# EAGLE schematic TLog_HighSpeedADC (EAGLE 8.3.0)

## Sheet 1 of 7: Main
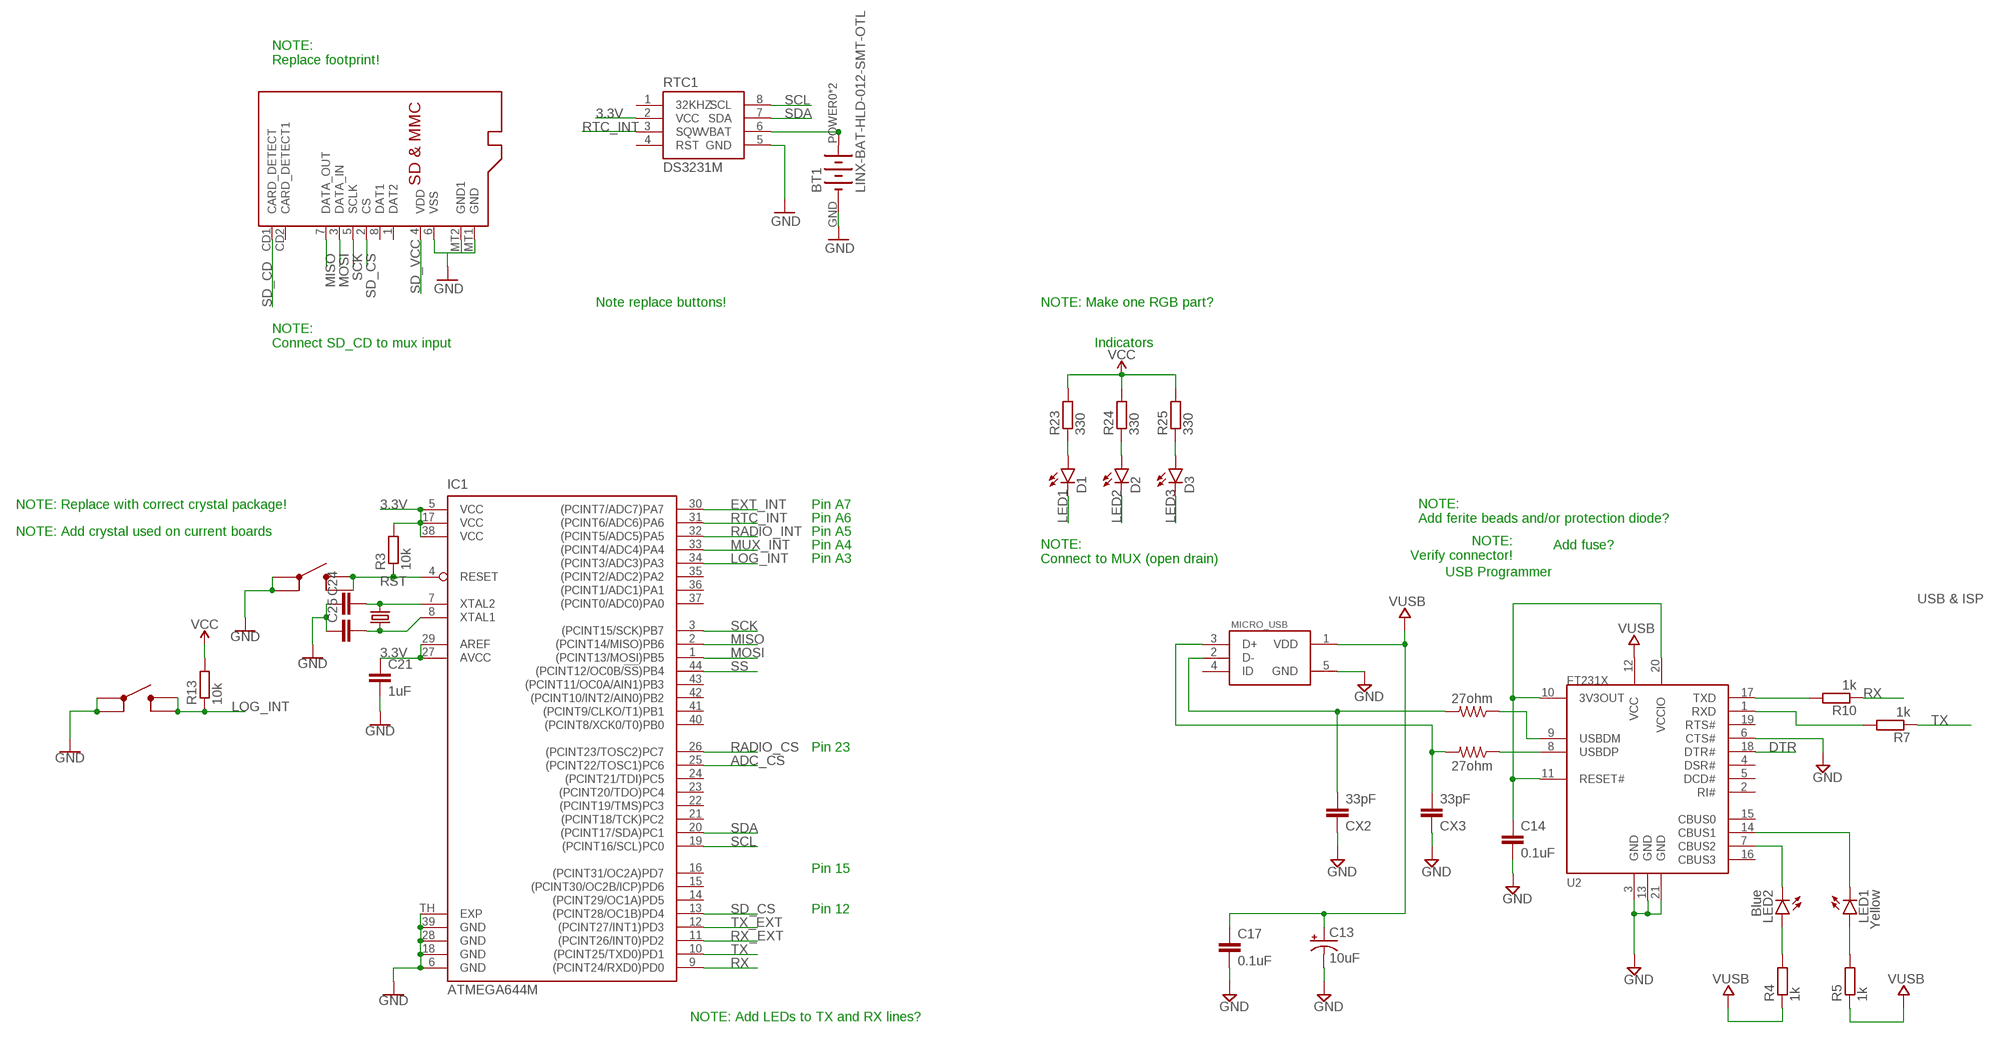
[diagram p0: schematic, sheet 1]

### Parts
BT1  LINX-BAT-HLD-012-SMT-OTL  [LINX_BAT-HLD-012-SMT]
C13  10uF  CAP_POL1206  [EIA3216]
C14  0.1uF  C-EUC0603  [C0603]
C17  0.1uF  C-EUC0603  [C0603]
C21  1uF  C-EUC0603  [C0603]
C24  C-EUC0603  [C0603]
C25  C-EUC0603  [C0603]
CX2  33pF  C-EUC0603  [C0603]
CX3  33pF  C-EUC0603  [C0603]
D1  LED0603  [LED-0603]
D2  LED0603  [LED-0603]
D3  LED0603  [LED-0603]
D+  27ohm  R-US_R0603  [R0603]
D-  27ohm  R-US_R0603  [R0603]
IC1  ATMEGA644M  [MLF44-TH]
LED1  Yellow  LED0603  [LED-0603]
LED2  Blue  LED0603  [LED-0603]
MICRO_USB  10118194-0001LF_LONGER_PADS  [10118194-0001LF_LONGER_PADS]
R3  10k  R-EU_R0603  [R0603]
R4  1k  R-EU_R0603  [R0603]
R5  1k  R-EU_R0603  [R0603]
R7  1k  R-EU_R0603  [R0603]
R10  1k  R-EU_R0603  [R0603]
R13  10k  R-EU_R0603  [R0603]
R23  330  R-EU_R0603  [R0603]
R24  330  R-EU_R0603  [R0603]
R25  330  R-EU_R0603  [R0603]
RTC1  DS3231M  [SO08]
U2  FT231X-Q  [QFN20]
U$1  CRYSTAL_5X3.2_2LEAD  [CRYSTAL_5X3.2_2-SMD]
U$2  MICROSD  [MICROSD]
U$5  SKRPABE010  [SKRPABE010_(SWITCH)]
U$9  SKRPABE010  [SKRPABE010_(SWITCH)]

### Nets
3.3V: C21.1 IC1.5(VCC) IC1.17(VCC) IC1.27(AVCC) IC1.29(AREF) IC1.38(VCC) R3.2 R13.2 R23.2 R24.2 R25.2 RTC1.2(VCC) ; supply symbol labelled VCC ; also sheet 3,4,5,6,7
ADC_CS: IC1.25((PCINT22/TOSC1)PC6)
DTR: U2.18(DTR#)
EXT_INT: IC1.30((PCINT7/ADC7)PA7) ; also sheet 6
GND: BT1.GND(-) C13.C(-) C14.2 C17.2 C21.2 C24.1 C25.1 CX2.1 CX3.1 IC1.6(GND) IC1.18(GND) IC1.28(GND) IC1.39(GND) IC1.TH(EXP) MICRO_USB.5(GND) RTC1.5(GND) U2.3(GND) U2.6(CTS#) U2.13(GND) U2.21(GND) U$2.6(VSS) U$2.MT1(GND) U$2.MT2(GND1) U$5.P$1 U$5.P$2 U$9.P$1 U$9.P$2 ; also sheet 2,3,4,5,6,7
LED1: D1.C ; also sheet 7
LED2: D2.C ; also sheet 7
LED3: D3.C ; also sheet 7
LOG_INT: IC1.34((PCINT3/ADC3)PA3) R13.1 U$5.P$3 U$5.P$4
MISO: IC1.2((PCINT14/MISO)PB6) U$2.7(DATA_OUT) ; also sheet 4,6
MOSI: IC1.1((PCINT13/MOSI)PB5) U$2.3(DATA_IN) ; also sheet 4,6
MUX_INT: IC1.33((PCINT4/ADC4)PA4) ; also sheet 7
N$5: C24.2 IC1.7(XTAL2) U$1.P$2
N$8: C25.2 IC1.8(XTAL1) U$1.P$1
N$25: R10.2 U2.17(TXD)
N$31: BT1.POWER0(+) BT1.POWER1(+) RTC1.6(VBAT)
N$32: D1.A R23.1
N$33: D2.A R24.1
N$34: D3.A R25.1
N$35: R7.2 U2.1(RXD)
N$36: CX3.2 D+.2 MICRO_USB.3(D+)
N$37: CX2.2 D-.2 MICRO_USB.2(D-)
N$38: D+.1 U2.8(USBDP)
N$39: C14.1 U2.10(3V3OUT) U2.11(RESET#) U2.20(VCCIO)
N$40: LED2.A R4.2
N$41: LED2.C U2.7(CBUS2)
N$42: LED1.A R5.2
N$43: LED1.C U2.14(CBUS1)
N$46: D-.1 U2.9(USBDM)
RADIO_CS: IC1.26((PCINT23/TOSC2)PC7) ; also sheet 4
RADIO_INT: IC1.32((PCINT5/ADC5)PA5) ; also sheet 4
RST: IC1.4(RESET) R3.1 U$9.P$3 U$9.P$4 ; also sheet 6
RTC_INT: IC1.31((PCINT6/ADC6)PA6) RTC1.3(SQW)
RX: IC1.9((PCINT24/RXD0)PD0) R10.1
RX_EXT: IC1.11((PCINT26/INT0)PD2) ; also sheet 6
SCK: IC1.3((PCINT15/SCK)PB7) U$2.5(SCLK) ; also sheet 4,6
SCL: IC1.19((PCINT16/SCL)PC0) RTC1.8(SCL) ; also sheet 4,6,7
SD_CD: U$2.CD1(CARD_DETECT)
SD_CS: IC1.13((PCINT28/OC1B)PD4) U$2.2(CS)
SD_VCC: U$2.4(VDD) ; also sheet 5
SDA: IC1.20((PCINT17/SDA)PC1) RTC1.7(SDA) ; also sheet 4,6,7
SS: IC1.44((PCINT12/OC0B/!SS!)PB4)
TX: IC1.10((PCINT25/TXD0)PD1) R7.1
TX_EXT: IC1.12((PCINT27/INT1)PD3) ; also sheet 6
VUSB: C13.A(+) C17.1 MICRO_USB.1(VDD) R4.1 R5.1 U2.12(VCC)
Unconnected: IC1.14((PCINT29/OC1A)PD5) IC1.15((PCINT30/OC2B/ICP)PD6) IC1.16((PCINT31/OC2A)PD7) IC1.21((PCINT18/TCK)PC2) IC1.22((PCINT19/TMS)PC3) IC1.23((PCINT20/TDO)PC4) IC1.24((PCINT21/TDI)PC5) IC1.35((PCINT2/ADC2)PA2) IC1.36((PCINT1/ADC1)PA1) IC1.37((PCINT0/ADC0)PA0) IC1.40((PCINT8/XCK0/T0)PB0) IC1.41((PCINT9/CLKO/T1)PB1) IC1.42((PCINT10/INT2/AIN0)PB2) IC1.43((PCINT11/OC0A/AIN1)PB3) MICRO_USB.4(ID) RTC1.1(32KHZ) RTC1.4(RST) U2.2(RI#) U2.4(DSR#) U2.5(DCD#) U2.15(CBUS0) U2.16(CBUS3) U2.19(RTS#) U$2.1(DAT2) U$2.8(DAT1) U$2.CD2(CARD_DETECT1)

### Notes on the sheet
- NOTE:
  Replace footprint!
- Note replace buttons! | NOTE: Make one RGB part?
- NOTE:
  Connect SD_CD to mux input
- Indicators
- NOTE: Replace with correct crystal package! | Pin A7
- Pin A6
- NOTE:
  Add ferite beads and/or protection diode?
- NOTE: Add crystal used on current boards | Pin A5
- NOTE:
  Verify connector!
- Pin A4 | Add fuse?
- Pin A3
- NOTE:
  Connect to MUX (open drain)
- USB Programmer
- USB & ISP
- Pin 23
- Pin 15
- Pin 12
- NOTE: Add LEDs to TX and RX lines?

## Sheet 2 of 7: User Custom
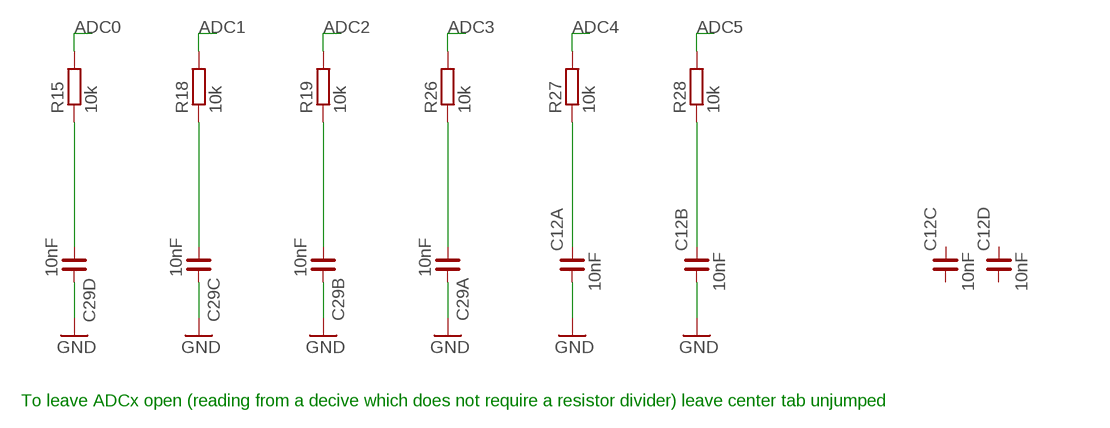
[diagram p1: schematic, sheet 2]

### Parts
C12  10nF  CCA_ECJ-1206  [CECJ-1206]
C29  10nF  CCA_ECJ-1206  [CECJ-1206]
R15  10k  R-EU_R0603  [R0603]
R18  10k  R-EU_R0603  [R0603]
R19  10k  R-EU_R0603  [R0603]
R26  10k  R-EU_R0603  [R0603]
R27  10k  R-EU_R0603  [R0603]
R28  10k  R-EU_R0603  [R0603]

### Nets
ADC0: R15.2 ; also sheet 6,7
ADC1: R18.2 ; also sheet 6,7
ADC2: R19.2 ; also sheet 6,7
ADC3: R26.2 ; also sheet 6,7
ADC4: R27.2 ; also sheet 6,7
ADC5: R28.2 ; also sheet 6,7
GND: C12.A1 C12.B1 C29.A2 C29.B2 C29.C2 C29.D2 ; also sheet 1,3,4,5,6,7
N$17: C12.B2 R28.1
N$19: C29.B1 R19.1
N$24: C29.A1 R26.1
N$44: C29.D1 R15.1
N$45: C29.C1 R18.1
N$48: C12.A2 R27.1
Unconnected: C12.C1 C12.C2 C12.D1 C12.D2

### Notes on the sheet
- To leave ADCx open (reading from a decive which does not require a resistor divider) leave center tab unjumped

## Sheet 3 of 7: Power
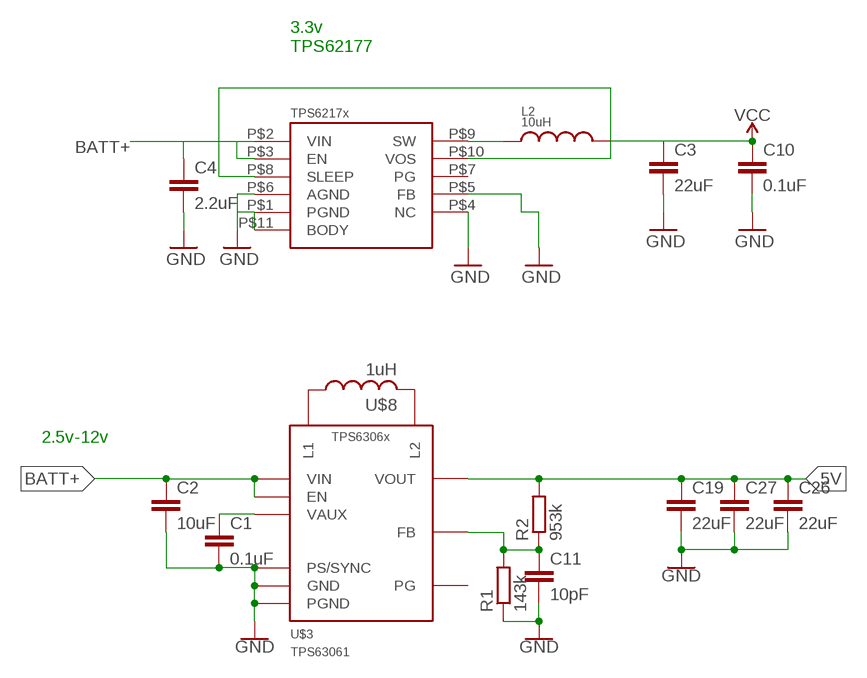
[diagram p2: schematic, sheet 3]

### Parts
C1  0.1uF  C-EUC0603  [C0603]
C2  10uF  C-EUC0603  [C0603]
C3  22uF  C-EUC1210  [C1210]
C4  2.2uF  C-EUC0603  [C0603]
C10  0.1uF  C-EUC0603  [C0603]
C11  10pF  C-EUC0603  [C0603]
C19  22uF  C-EUC0603  [C0603]
C26  22uF  C-EUC0603  [C0603]
C27  22uF  C-EUC0603  [C0603]
L2  10uH  WE-LSQ(INDUCTOR)  [WE-LQS(INDUCTOR)]
R1  143k  R-EU_R0603  [R0603]
R2  953k  R-EU_R0603  [R0603]
U$3  TPS63061  TPS306X  [WSON-10]
U$4  TPS6217X  [WSON-10]
U$8  1uH  WE-MAIA(INDUCTOR)  [WE-MAIA(4.1X4.1)]

### Nets
3.3V: C3.1 C10.1 L2.P$2 U$4.P$8(SLEEP) U$4.P$10(VOS) ; supply symbol labelled VCC ; also sheet 1,4,5,6,7
5V: C19.1 C26.1 C27.1 R2.2 U$3.P$9(VOUT) ; also sheet 5,6,7
BATT+: C2.1 C4.1 U$3.P$2(VIN) U$3.P$3(EN) U$4.P$2(VIN) U$4.P$3(EN) ; also sheet 6,7
GND: C1.2 C2.2 C3.2 C4.2 C10.2 C11.2 C19.2 C26.2 C27.2 R1.1 U$3.P$4(PS/SYNC) U$3.P$7(GND) U$3.P$11(PGND) U$4.P$1(PGND) U$4.P$4(NC) U$4.P$5(FB) U$4.P$6(AGND) U$4.P$11(BODY) ; also sheet 1,2,4,5,6,7
N$1: U$3.P$10(L2) U$8.P$2
N$2: L2.P$1 U$4.P$9(SW)
N$3: U$3.P$1(L1) U$8.P$1
N$4: C1.1 U$3.P$6(VAUX)
N$6: C11.1 R1.2 R2.1 U$3.P$8(FB)
Unconnected: U$3.P$5(PG) U$4.P$7(PG)

### Notes on the sheet
- 3.3v
  TPS62177
- 2.5v-12v

## Sheet 4 of 7: RF
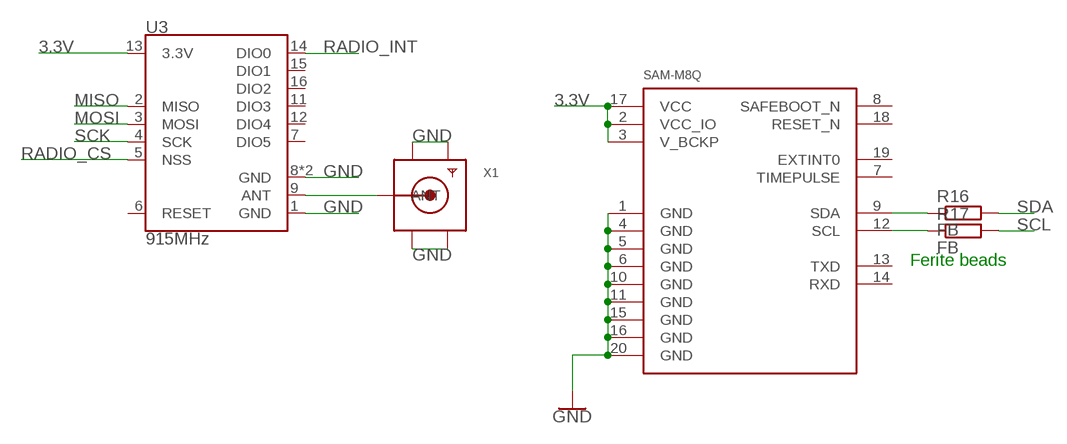
[diagram p3: schematic, sheet 4]

### Parts
R16  FB  R-EU_R0603  [R0603]
R17  FB  R-EU_R0603  [R0603]
U3  915MHz  RFM69HCW-915  [RFM69HCW-XXXS2]
U$6  SAM-M8Q  [SAM-M8Q]
X1  SMACONNECTOR_EDGE  [SMA_EDGELAUNCH]

### Nets
3.3V: U3.13(3.3V) U$6.2(VCC_IO) U$6.3(V_BCKP) U$6.17(VCC) ; also sheet 1,3,5,6,7
GND: U3.1(GND) U3.8(GND) U3.10(GND) U$6.1(GND) U$6.4(GND) U$6.5(GND) U$6.6(GND) U$6.10(GND) U$6.11(GND) U$6.15(GND) U$6.16(GND) U$6.20(GND) X1.GND@1(GND4) X1.GND@2(GND3) X1.GND@3(GND2) X1.GND@4(GND1) ; also sheet 1,2,3,5,6,7
MISO: U3.2(MISO) ; also sheet 1,6
MOSI: U3.3(MOSI) ; also sheet 1,6
N$20: R16.1 U$6.9(SDA)
N$21: R17.1 U$6.12(SCL)
N$28: U3.9(ANT) X1.P(ANT)
RADIO_CS: U3.5(NSS) ; also sheet 1
RADIO_INT: U3.14(DIO0) ; also sheet 1
SCK: U3.4(SCK) ; also sheet 1,6
SCL: R17.2 ; also sheet 1,6,7
SDA: R16.2 ; also sheet 1,6,7
Unconnected: U3.6(RESET) U3.7(DIO5) U3.11(DIO3) U3.12(DIO4) U3.15(DIO1) U3.16(DIO2) U$6.7(TIMEPULSE) U$6.8(SAFEBOOT_N) U$6.13(TXD) U$6.14(RXD) U$6.18(RESET_N) U$6.19(EXTINT0)

### Notes on the sheet
- Ferite beads

## Sheet 5 of 7: Power Control
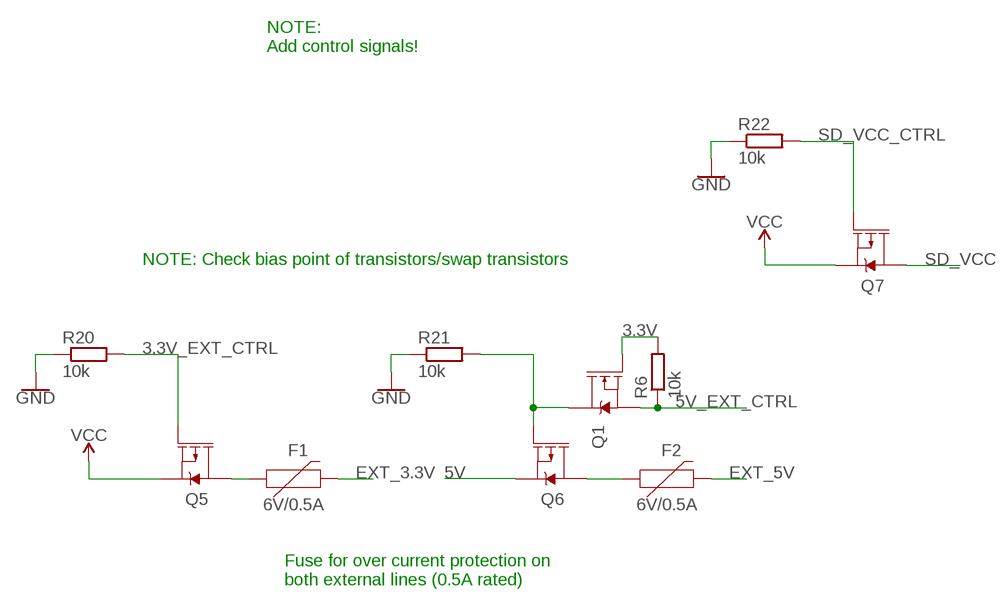
[diagram p4: schematic, sheet 5]

### Parts
F1  6V/0.5A  PPTC_HALF-AMP  [1206]
F2  6V/0.5A  PPTC_HALF-AMP  [1206]
Q1  220mA/50V/3.5Ω  MOSFET-NCH-BSS138  [SOT23-3]
Q5  4.3A/20V/54mΩ  MOSFET_PCH-IRLML2244  [SOT23-3]
Q6  4.3A/20V/54mΩ  MOSFET_PCH-IRLML2244  [SOT23-3]
Q7  4.3A/20V/54mΩ  MOSFET_PCH-IRLML2244  [SOT23-3]
R6  10k  R-EU_R0603  [R0603]
R20  10k  R-EU_R0603  [R0603]
R21  10k  R-EU_R0603  [R0603]
R22  10k  R-EU_R0603  [R0603]

### Nets
3.3V: Q1.1(G) Q5.2(S) Q7.2(S) R6.2 ; supply symbol labelled VCC ; also sheet 1,3,4,6,7
3.3V_EXT_CTRL: Q5.1(G) R20.2 ; also sheet 7
5V: Q6.2(S) ; also sheet 3,6,7
5V_EXT_CTRL: Q1.2(S) R6.1 ; also sheet 7
EXT_3.3V: F1.2 ; also sheet 6
EXT_5V: F2.2 ; also sheet 6
GND: R20.1 R21.1 R22.1 ; also sheet 1,2,3,4,6,7
N$14: F1.1 Q5.3(D)
N$18: F2.1 Q6.3(D)
N$30: Q1.3(D) Q6.1(G) R21.2
SD_VCC: Q7.3(D) ; also sheet 1
SD_VCC_CTRL: Q7.1(G) R22.2 ; also sheet 7

### Notes on the sheet
- NOTE:
  Add control signals!
- NOTE: Check bias point of transistors/swap transistors
- Fuse for over current protection on
  both external lines (0.5A rated)

## Sheet 6 of 7: Ports
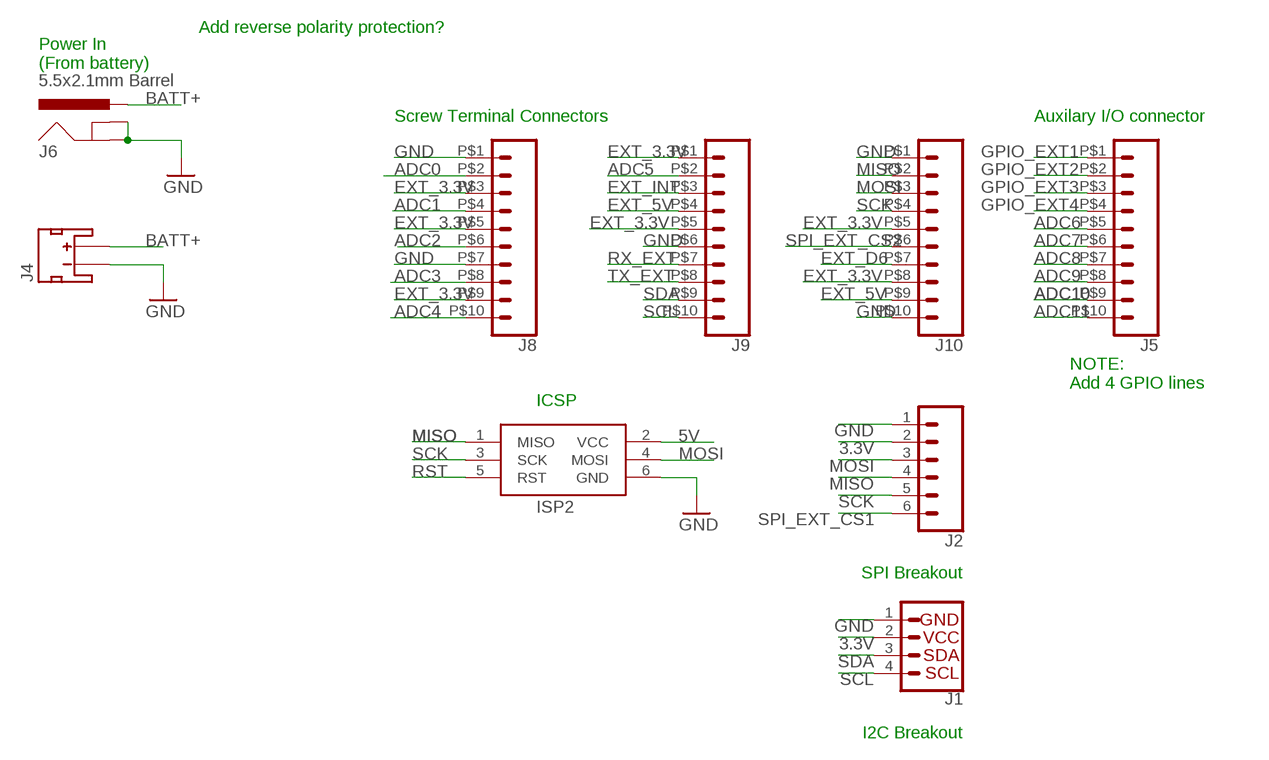
[diagram p5: schematic, sheet 6]

### Parts
ISP2  AVRISP-6  [AVRISP]
J1  I2C_STANDARD  [1X04]
J2  CONN_06SILK_FEMALE_PTH  [1X06]
J4  JST_2MM_MALE  [JST-2-SMD]
J5  CONN_10  [SCREWTERMINAL-3.5MM-10]
J6  5.5x2.1mm Barrel  POWER_JACKSMD  [POWER_JACK_SMD]
J8  CONN_10  [SCREWTERMINAL-3.5MM-10]
J9  CONN_10  [SCREWTERMINAL-3.5MM-10]
J10  CONN_10  [SCREWTERMINAL-3.5MM-10]

### Nets
3.3V: J1.2 J2.2 ; also sheet 1,3,4,5,7
5V: ISP2.2(VCC) ; also sheet 3,5,7
ADC0: J8.P$2 ; also sheet 2,7
ADC1: J8.P$4 ; also sheet 2,7
ADC2: J8.P$6 ; also sheet 2,7
ADC3: J8.P$8 ; also sheet 2,7
ADC4: J8.P$10 ; also sheet 2,7
ADC5: J9.P$2 ; also sheet 2,7
ADC6: J5.P$5 ; also sheet 7
ADC7: J5.P$6 ; also sheet 7
ADC8: J5.P$7 ; also sheet 7
ADC9: J5.P$8 ; also sheet 7
ADC10: J5.P$9 ; also sheet 7
ADC11: J5.P$10 ; also sheet 7
BATT+: J4.2(+) J6.VIN0(PWR) ; also sheet 3,7
EXT_3.3V: J8.P$3 J8.P$5 J8.P$9 J9.P$1 J9.P$5 J10.P$5 J10.P$8 ; also sheet 5
EXT_5V: J9.P$4 J10.P$9 ; also sheet 5
EXT_D6: J10.P$7 ; also sheet 7
EXT_INT: J9.P$3 ; also sheet 1
GND: ISP2.6(GND) J1.1 J2.1 J4.1(-) J6.GND(GNDBREAK) J6.P$4(GND) J8.P$1 J8.P$7 J9.P$6 J10.P$1 J10.P$10 ; also sheet 1,2,3,4,5,7
GPIO_EXT1: J5.P$1 ; also sheet 7
GPIO_EXT2: J5.P$2 ; also sheet 7
GPIO_EXT3: J5.P$3 ; also sheet 7
GPIO_EXT4: J5.P$4 ; also sheet 7
MISO: ISP2.1(MISO) J2.4 J10.P$2 ; also sheet 1,4
MOSI: ISP2.4(MOSI) J2.3 J10.P$3 ; also sheet 1,4
RST: ISP2.5(RST) ; also sheet 1
RX_EXT: J9.P$7 ; also sheet 1
SCK: ISP2.3(SCK) J2.5 J10.P$4 ; also sheet 1,4
SCL: J1.4 J9.P$10 ; also sheet 1,4,7
SDA: J1.3 J9.P$9 ; also sheet 1,4,7
SPI_EXT_CS1: J2.6 ; also sheet 7
SPI_EXT_CS2: J10.P$6 ; also sheet 7
TX_EXT: J9.P$8 ; also sheet 1
Unconnected: J4.NC1(PAD1) J4.NC2(PAD2)

### Notes on the sheet
- Add reverse polarity protection?
- Power In
  (From battery)
- Screw Terminal Connectors | Auxilary I/O connector
- NOTE:
  Add 4 GPIO lines
- ICSP
- SPI Breakout
- I2C Breakout

## Sheet 7 of 7: IO
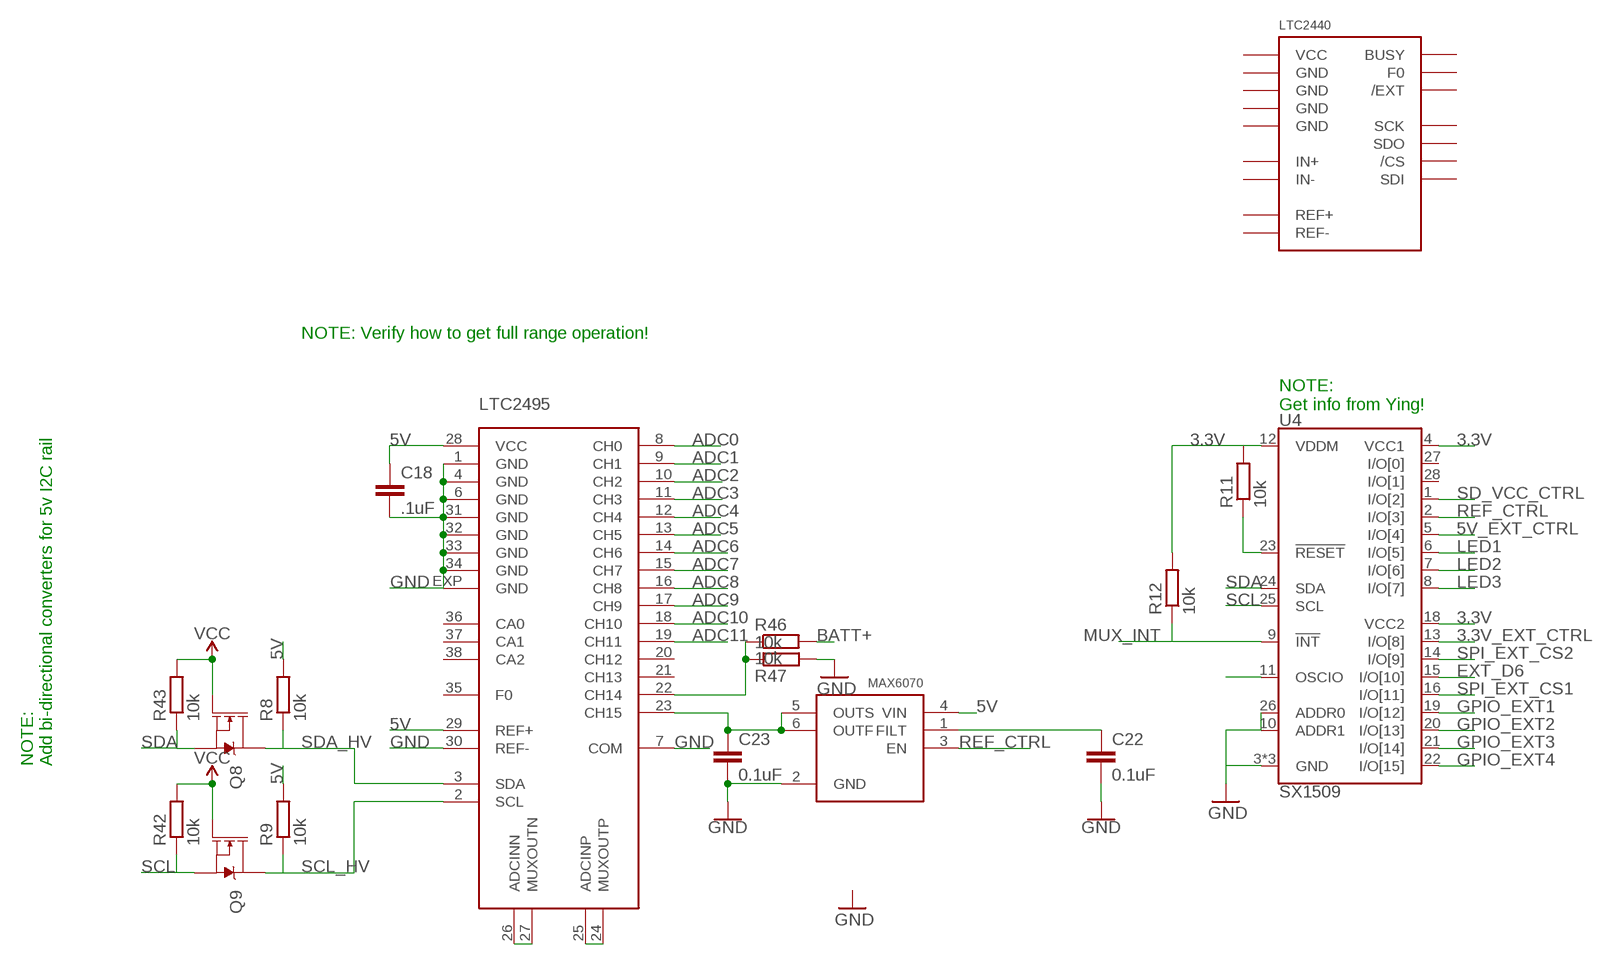
[diagram p6: schematic, sheet 7]

### Parts
C18  .1uF  C-EUC0603  [C0603]
C22  0.1uF  C-EUC0603  [C0603]
C23  0.1uF  C-EUC0603  [C0603]
Q8  220mA/50V/3.5Ω  MOSFET-NCH-BSS138  [SOT23-3]
Q9  220mA/50V/3.5Ω  MOSFET-NCH-BSS138  [SOT23-3]
R8  10k  R-EU_R0603  [R0603]
R9  10k  R-EU_R0603  [R0603]
R11  10k  R-EU_R0603  [R0603]
R12  10k  R-EU_R0603  [R0603]
R42  10k  R-EU_R0603  [R0603]
R43  10k  R-EU_R0603  [R0603]
R46  10k  R-EU_R0603  [R0603]
R47  10k  R-EU_R0603  [R0603]
U4  SX1509  [QFN-28]
U$7  LTC2495  [QFN38-5X7]
U$10  MAX6070  [SOT23-6L]
U$15  LTC2440  [SSOP16]

### Nets
3.3V: Q8.1(G) Q9.1(G) R11.2 R12.2 R42.2 R43.2 U4.4(VCC1) U4.12(VDDM) U4.18(VCC2) ; supply symbol labelled VCC ; also sheet 1,3,4,5,6
3.3V_EXT_CTRL: U4.13(I/O[8]) ; also sheet 5
5V: C18.1 R8.2 R9.2 U$7.28(VCC) U$7.29(REF+) U$10.4(VIN) ; also sheet 3,5,6
5V_EXT_CTRL: U4.5(I/O[4]) ; also sheet 5
ADC0: U$7.8(CH0) ; also sheet 2,6
ADC1: U$7.9(CH1) ; also sheet 2,6
ADC2: U$7.10(CH2) ; also sheet 2,6
ADC3: U$7.11(CH3) ; also sheet 2,6
ADC4: U$7.12(CH4) ; also sheet 2,6
ADC5: U$7.13(CH5) ; also sheet 2,6
ADC6: U$7.14(CH6) ; also sheet 6
ADC7: U$7.15(CH7) ; also sheet 6
ADC8: U$7.16(CH8) ; also sheet 6
ADC9: U$7.17(CH9) ; also sheet 6
ADC10: U$7.18(CH10) ; also sheet 6
ADC11: U$7.19(CH11) ; also sheet 6
BATT+: R46.2 ; also sheet 3,6
EXT_D6: U4.15(I/O[10]) ; also sheet 6
GND: C18.2 C22.2 C23.2 R47.2 U4.3(GND) U4.10(ADDR1) U4.17(GND) U4.26(ADDR0) U4.29(GND) U$7.1(GND) U$7.4(GND) U$7.6(GND) U$7.7(COM) U$7.30(REF-) U$7.31(GND) U$7.32(GND) U$7.33(GND) U$7.34(GND) U$7.EXP(GND) U$10.2(GND) ; also sheet 1,2,3,4,5,6
GPIO_EXT1: U4.19(I/O[12]) ; also sheet 6
GPIO_EXT2: U4.20(I/O[13]) ; also sheet 6
GPIO_EXT3: U4.21(I/O[14]) ; also sheet 6
GPIO_EXT4: U4.22(I/O[15]) ; also sheet 6
LED1: U4.6(I/O[5]) ; also sheet 1
LED2: U4.7(I/O[6]) ; also sheet 1
LED3: U4.8(I/O[7]) ; also sheet 1
MUX_INT: R12.1 U4.9(!INT) ; also sheet 1
N$13: U$7.26(ADCINN) U$7.27(MUXOUTN)
N$22: C22.1 U$10.1(FILT)
N$23: C23.1 U$7.23(CH15) U$10.5(OUTS) U$10.6(OUTF)
N$27: U4.11(OSCIO)
N$52: U$7.24(MUXOUTP) U$7.25(ADCINP)
N$54: R46.1 R47.1 U$7.22(CH14)
N$56: R11.1 U4.23(!RESET)
REF_CTRL: U4.2(I/O[3]) U$10.3(EN)
SCL: Q9.2(S) R42.1 U4.25(SCL) ; also sheet 1,4,6
SCL_HV: Q9.3(D) R9.1 U$7.2(SCL)
SD_VCC_CTRL: U4.1(I/O[2]) ; also sheet 5
SDA: Q8.2(S) R43.1 U4.24(SDA) ; also sheet 1,4,6
SDA_HV: Q8.3(D) R8.1 U$7.3(SDA)
SPI_EXT_CS1: U4.16(I/O[11]) ; also sheet 6
SPI_EXT_CS2: U4.14(I/O[9]) ; also sheet 6
Unconnected: U4.27(I/O[0]) U4.28(I/O[1]) U$7.20(CH12) U$7.21(CH13) U$7.35(F0) U$7.36(CA0) U$7.37(CA1) U$7.38(CA2) U$15.1(GND) U$15.2(VCC) U$15.3(REF+) U$15.4(REF-) U$15.5(IN+) U$15.6(IN-) U$15.7(SDI) U$15.8(GND) U$15.9(GND) U$15.10(/EXT) U$15.11(/CS) U$15.12(SDO) U$15.13(SCK) U$15.14(F0) U$15.15(BUSY) U$15.16(GND)

### Notes on the sheet
- NOTE: Verify how to get full range operation!
- NOTE:
  Get info from Ying!
- NOTE:
  Add bi-directional converters for 5v I2C rail

## Library data of the parts
BT1 = awickert:LINX-BAT-HLD-012-SMT-OTL
C1-C4 C10 C11 C18 C19 C21-C27 = rcl:C-EU: CAPACITOR, European symbol
C12 C29 = rc-master-smd:CCA_: CHIP CAP ARRAY
C13 = SparkFun-Passives:CAP_POL: Capacitor Polarized These are standard SMD and PTH capacitors. Normally 10uF, 47uF, and 100uF in electrolytic and tantalum varieties. Always verify the external diameter of the through hole cap, it varies with capacity, voltage, and manufacturer. The EIA devices should be standard.
C14 C17 CX2 CX3 = resistor:C-EU: CAPACITOR, European symbol
D1-D3 LED1 LED2 = SparkFun-LED:LED: LEDs Standard schematic elements and footprints for 5mm, 3mm, 1206, and 0603 sized LEDs. 5mm - Spark Fun Electronics SKU : COM-00529 (and others)
D+ D- = rcl:R-US_: RESISTOR, American symbol
F1 F2 = SparkFun-Fuses:PPTC: Resettable Fuse PPTC Resettable Fuse. Really a sort of resistor with a polymeric positive temperature coefficient whose resistance increases dramatically with an increase in temperature. When heated by the power passing through the resistance rises causing the current to be limited, protecting the circuit. This is achieved by the transition of the polymer from a crystalline to an amorphous state where the conductive carbon separates breaking the conductive pathways found in the cool crystalline structure. When a PPTC cools back down it resumes conducting letting the circuit turn back on. SparkFun Products: SparkFun RedBoard - Programmed with Arduino <https://www.sparkfun.com/products/12757> Pro Micro - 5V/16MHz <https://www.sparkfun.com/products/12640> Arduino Pro 328 - 5V/16MHz <https://www.sparkfun.com/products/10915> MP3 Trigger <https://www.sparkfun.com/products/13720>; PROD_ID: RES-08585
IC1 = atmel:ATMEGA644*: 8-bit Microcontroller with 64K Bytes In-System Programmable Flash Source: http://www.atmel.com/dyn/resources/prod_documents/doc2593.pdf; MPN: ATMEGA644P-20MU; OC_FARNELL: 1748528; OC_NEWARK: 26R5636
ISP2 = adafruit:AVRISP: AVR ISP HEADER Standard 6 pin header for AVR programming
J1 = SparkFun-Connectors:I2C_STANDARD: SparkFun I2C Standard Pinout Header SparkFun has standardized on a pinout for all I2C based sensor breakouts. This pinout allows I2C boards to be plugged directly into the headers on Arduino Uno compatible boards, and to be daisy chained easily. Example SparkFun Products: SparkFun Atmospheric Sensor Breakout - BME280 <https://www.sparkfun.com/products/13676> SparkFun Altitude/Pressure Sensor Breakout - MPL3115A2 <https://www.sparkfun.com/products/11084> SparkFun TOF Range Finder Sensor - VL6180 <https://www.sparkfun.com/products/12785>
J2 = SparkFun-Connectors:CONN_06: Multi connection point. Often used as Generic Header-pin footprint for 0.1 inch spaced/style header connections On any of the 0.1 inch spaced packages, you can populate with these: Break Away Headers - Straight <https://www.sparkfun.com/products/116> (PRT-00116) Break Away Male Headers - Right Angle <https://www.sparkfun.com/products/553> (PRT-00553) Female Headers <https://www.sparkfun.com/products/115> (PRT-00115) Break Away Headers - Machine Pin <https://www.sparkfun.com/products/117> (PRT-00117) Break Away Female Headers - Swiss Machine Pin <https://www.sparkfun.com/products/743> (PRT-00743) Arduino Stackable Header - 6 Pin <https://www.sparkfun.com/products/9280> (PRT-09280) For SCREWTERMINALS and SPRING TERMINALS visit here: Screw Terimnals on SparkFun.com <https://www.sparkfun.com/search/results?term=Screw+Terminals> (5mm/3.5mm/2.54mm spacing) This device is also useful as a general connection point to wire up your design to another part of your project. Our various solder wires solder well into these plated through hole pads. Hook-Up Wire - Assortment (Stranded, 22 AWG) <https://www.sparkfun.com/products/11375> (PRT-11375) Hook-Up Wire - Assortment (Solid Core, 22 AWG) <https://www.sparkfun.com/products/11367> (PRT-11367) View the entire wire category on our website here <https://www.sparkfun.com/categories/141>; PROD_ID: CONN-08437
J4 = SparkFun-Connectors:JST_2MM_MALE: JST 2MM MALE RA CONNECTOR Two pin, compact surface mount connector. Commonly used as a battery input connection point. We really like the solid locking feeling and high current rating on these small connectors. We use these all the time as battery connectors. Mates to single-cell LiPo batteries. Here is the connector we sell at SparkFun: JST Right Angle Connector - White <https://www.sparkfun.com/products/8612> (PRT-08612) Datasheet <http://www.sparkfun.com/datasheets/Prototyping/Connectors/JST-Horizontal.pdf> It was used on these SparkFun products: SparkFun MOSFET Power Controller <https://www.sparkfun.com/products/11214> (PRT-11214) SparkFun Battery Babysitter - LiPo Battery Manager <https://www.sparkfun.com/products/13777> (PRT-13777) And many, many others that required a lipo battery connection.; PROD_ID: CONN-11443; SF_ID: PRT-08612
J5 J8-J10 = SparkFun-Connectors:CONN_10: Multi connection point. Often used as Generic Header-pin footprint for 0.1 inch spaced/style header connections On any of the 0.1 inch spaced packages, you can populate with these: Break Away Headers - Straight <https://www.sparkfun.com/products/116> (PRT-00116) Break Away Male Headers - Right Angle <https://www.sparkfun.com/products/553> (PRT-00553) Female Headers <https://www.sparkfun.com/products/115> (PRT-00115) Break Away Headers - Machine Pin <https://www.sparkfun.com/products/117> (PRT-00117) Break Away Female Headers - Swiss Machine Pin <https://www.sparkfun.com/products/743> (PRT-00743) Arduino Stackable Header - 10 Pin <https://www.sparkfun.com/products/11376> (PRT-11376) For SCREWTERMINALS and SPRING TERMINALS visit here: Screw Terimnals on SparkFun.com <https://www.sparkfun.com/search/results?term=Screw+Terminals> (5mm/3.5mm/2.54mm spacing) This device is also useful as a general connection point to wire up your design to another part of your project. Our various solder wires solder well into these plated through hole pads. Hook-Up Wire - Assortment (Stranded, 22 AWG) <https://www.sparkfun.com/products/11375> (PRT-11375) Hook-Up Wire - Assortment (Solid Core, 22 AWG) <https://www.sparkfun.com/products/11367> (PRT-11367) View the entire wire category on our website here <https://www.sparkfun.com/categories/141> Special notes: Molex polarized connector foot print use with SKU : PRT-08231 with associated crimp pins and housings. 1MM SMD Version SKU: PRT-10208 NOTES ON THE VARIANTS LOCK and LOCK_LONGPADS... This footprint was designed to help hold the alignment of a through-hole component (i.e. 6-pin header) while soldering it into place. You may notice that each hole has been shifted either up or down by 0.005 of an inch from it's more standard position (which is a perfectly straight line). This slight alteration caused the pins (the squares in the middle) to touch the edges of the holes. Because they are alternating, it causes a "brace" to hold the component in place. 0.005 has proven to be the perfect amount of "off-center" position when using our standard breakaway headers. Although looks a little odd when you look at the bare footprint, once you have a header in there, the alteration is very hard to notice. Also,if you push a header all the way into place, it is covered up entirely on the bottom side.
J6 = SparkFun-Connectors:POWER_JACK: Power Jack Connector This is the standard 5.5mm barrel jack for power. The PTH is the most common, proven, reliable, footprint. The Slot footprint only works if the mill layer is transmitted to the PCB fab house so be warned. Here are the connectors we sell at SparkFun: DC Barrel Power Jack/Connector <https://www.sparkfun.com/products/119> (PRT-00119) DC Barrel Power Jack/Connector (SMD) <https://www.sparkfun.com/products/12748> (PRT-12748) DC Barrel Jack Adapter - Breadboard Compatible <https://www.sparkfun.com/products/10811> (PRT-10811) It is used on this SparkFun product (and many, many others): SparkFun RedBoard - Programmed with Arduino <https://www.sparkfun.com/products/12757> (DEV-12757) Also, if you need a mating power supply or connector, please check these out: Wall Adapter Power Supply - 9VDC 650mA <https://www.sparkfun.com/products/298> (TOL-00298) DC Barrel Jack Adapter - Male <https://www.sparkfun.com/products/10287> (PRT-10287); PROD_ID: CONN-08106; SF_ID: PRT-12748
L2 = Custom:WE-LSQ(INDUCTOR)
MICRO_USB = 10118194-0001LF:10118194-0001LF_LONGER_PADS
Q1 Q8 Q9 = SparkFun-DiscreteSemi:MOSFET-NCH: N-channel MOSFETs Voltage controlled devices that allow control of high current outputs. SparkFun Products: SparkFun OpenScale <https://www.sparkfun.com/products/13261> SparkFun Digital Sandbox <https://www.sparkfun.com/products/12651> SparkFun Monster Moto Shield <https://www.sparkfun.com/products/10182> SparkFun MOSFET Power Controller <https://www.sparkfun.com/products/11214>; PROD_ID: TRANS-00830
Q5-Q7 = SparkFun-DiscreteSemi:MOSFET_PCH: P-channel MOSFETs Voltage controlled devices that allow control of high current outputs. SparkFun Products: SparkFun ESP32 Thing <https://www.sparkfun.com/products/13907> SparkFun ESP8266 Thing <https://www.sparkfun.com/products/13231>; PROD_ID: TRANS-11153
R1-R5 R7-R12 R15-R28 R42 R43 R46 R47 = rcl:R-EU_: RESISTOR, European symbol
R6 R13 = resistor:R-EU_: RESISTOR, European symbol
RTC1 = SparkFun-Clocks:DS3231M: DS3231M Real Time Clock Accuracy +/-5ppm. Battery Backup. 2.3V to 5.5V. Datasheet <https://cdn.sparkfun.com/datasheets/Dev/Beagle/DS3231M.pdf> SparkFun Products CryptoCape <https://www.sparkfun.com/products/12773> (DEV-12773) SparkFun CryptoShield <https://www.sparkfun.com/products/13183> (DEV-13183); PROD_ID: IC-11985
U2 = FT231X:FT231X
U3 = SparkFun-RF:RFM69H: Hope RF RFM69H ISM Transceiver Module The RFM69H is a transceiver module capable of operation over a wide frequency range, including the 315,433,868 and 915MHz license-free ISM (Industry Scientific and Medical) frequency bands. All major RF communication parameters are programmable and most of them can be dynamically set. The RFM69H offers the unique advantage of programmable narrow-band and wide- band communication modes. The RFM69H is optimized for low power consumption while offering high RF output power and channelized operation.Compliance ETSI and FCC regulations. Datasheet <http://www.hoperf.cn/upload/docs/RF/SX/RFM69H_DataSheet_v1.3.pdf> SparkFun Products RFM69HCW Wireless Transceiver - 915MHz <https://www.sparkfun.com/products/13909> (COM-13909) RFM69HCW Wireless Transceiver - 434MHz <https://www.sparkfun.com/products/13910> (COM-13910) SparkFun RFM69 Breakout (915MHz) <https://www.sparkfun.com/products/12775> (WRL-12775) SparkFun RFM69 Breakout (434MHz) <https://www.sparkfun.com/products/12823> (WRL-12823); PROD_ID: IC-11997
U4 = SparkFun-IC-Special-Function:SX1509: Semtech SX1509 The SX1509 is a complete ultra low voltage 1.2V to 3.6V General Purpose parallel Input/Output (GPIO) expanders ideal for low power handheld battery powered equipment. This version comes in a 16-channel configuration and allows easy serial expansion of I/O through a standard 400kHz I2C interface. GPIO devices can provide additional control and monitoring when the microcontroller or chipset has insufficient I/O ports, or in systems where serial communication and control from a remote location is advantageous. Datasheet <http://cdn.sparkfun.com/datasheets/BreakoutBoards/sx1509.pdf> SparkFun Products SparkFun 16 Output I/O Expander Breakout - SX1509 <https://www.sparkfun.com/products/13601> (BOB-13601) SparkFun Line Follower Array <https://www.sparkfun.com/products/13582> (SEN-13582); PROD_ID: IC-11311
U$1 = bschulz:CRYSTAL_5X3.2_2LEAD: TXC Crystal, 5 x 3.2mm, SMD, 2 Lead 8 MHz PN = 887-2634-1-ND
U$2 = adafruit:MICROSD: Micro-SD / Transflash card holder with SPI pinout For the 3M # 2908-05WB-MG and/or 4UCON #19656 push-push type
U$3 = Custom:TPS306X: High input voltage buck-boost converter, 2A switch current, Vin = 2.5V to 12V
U$4 = texas:TPS6217X
U$5 U$9 = Custom:SKRPABE010: SPST Switch Rated to 50 mA 16V (DC)
U$6 = bschulz:SAM-M8Q: SAM-M8Q, Ublox 8 series with an integrated antenna
U$7 = linear-technology:LTC2495
U$8 = Custom:WE-MAIA(INDUCTOR): Wurth MAIA series inductor (https://www.digikey.com/products/en?FV=ffecb9d7,ffe00047)
U$10 = bschulz:MAX6070: MAX6070 Low Noise high precision voltage referance
U$15 = bschulz:LTC2440: Linear Technology ADC, 24 bit, 3.5ksps, SPI
X1 = adafruit:SMACONNECTOR: SMA Connector 90° DIP SMA Connector, 50 Ohm (4UConnector: 07259)